# EAGLE schematic D710-gps (EAGLE 6.4)
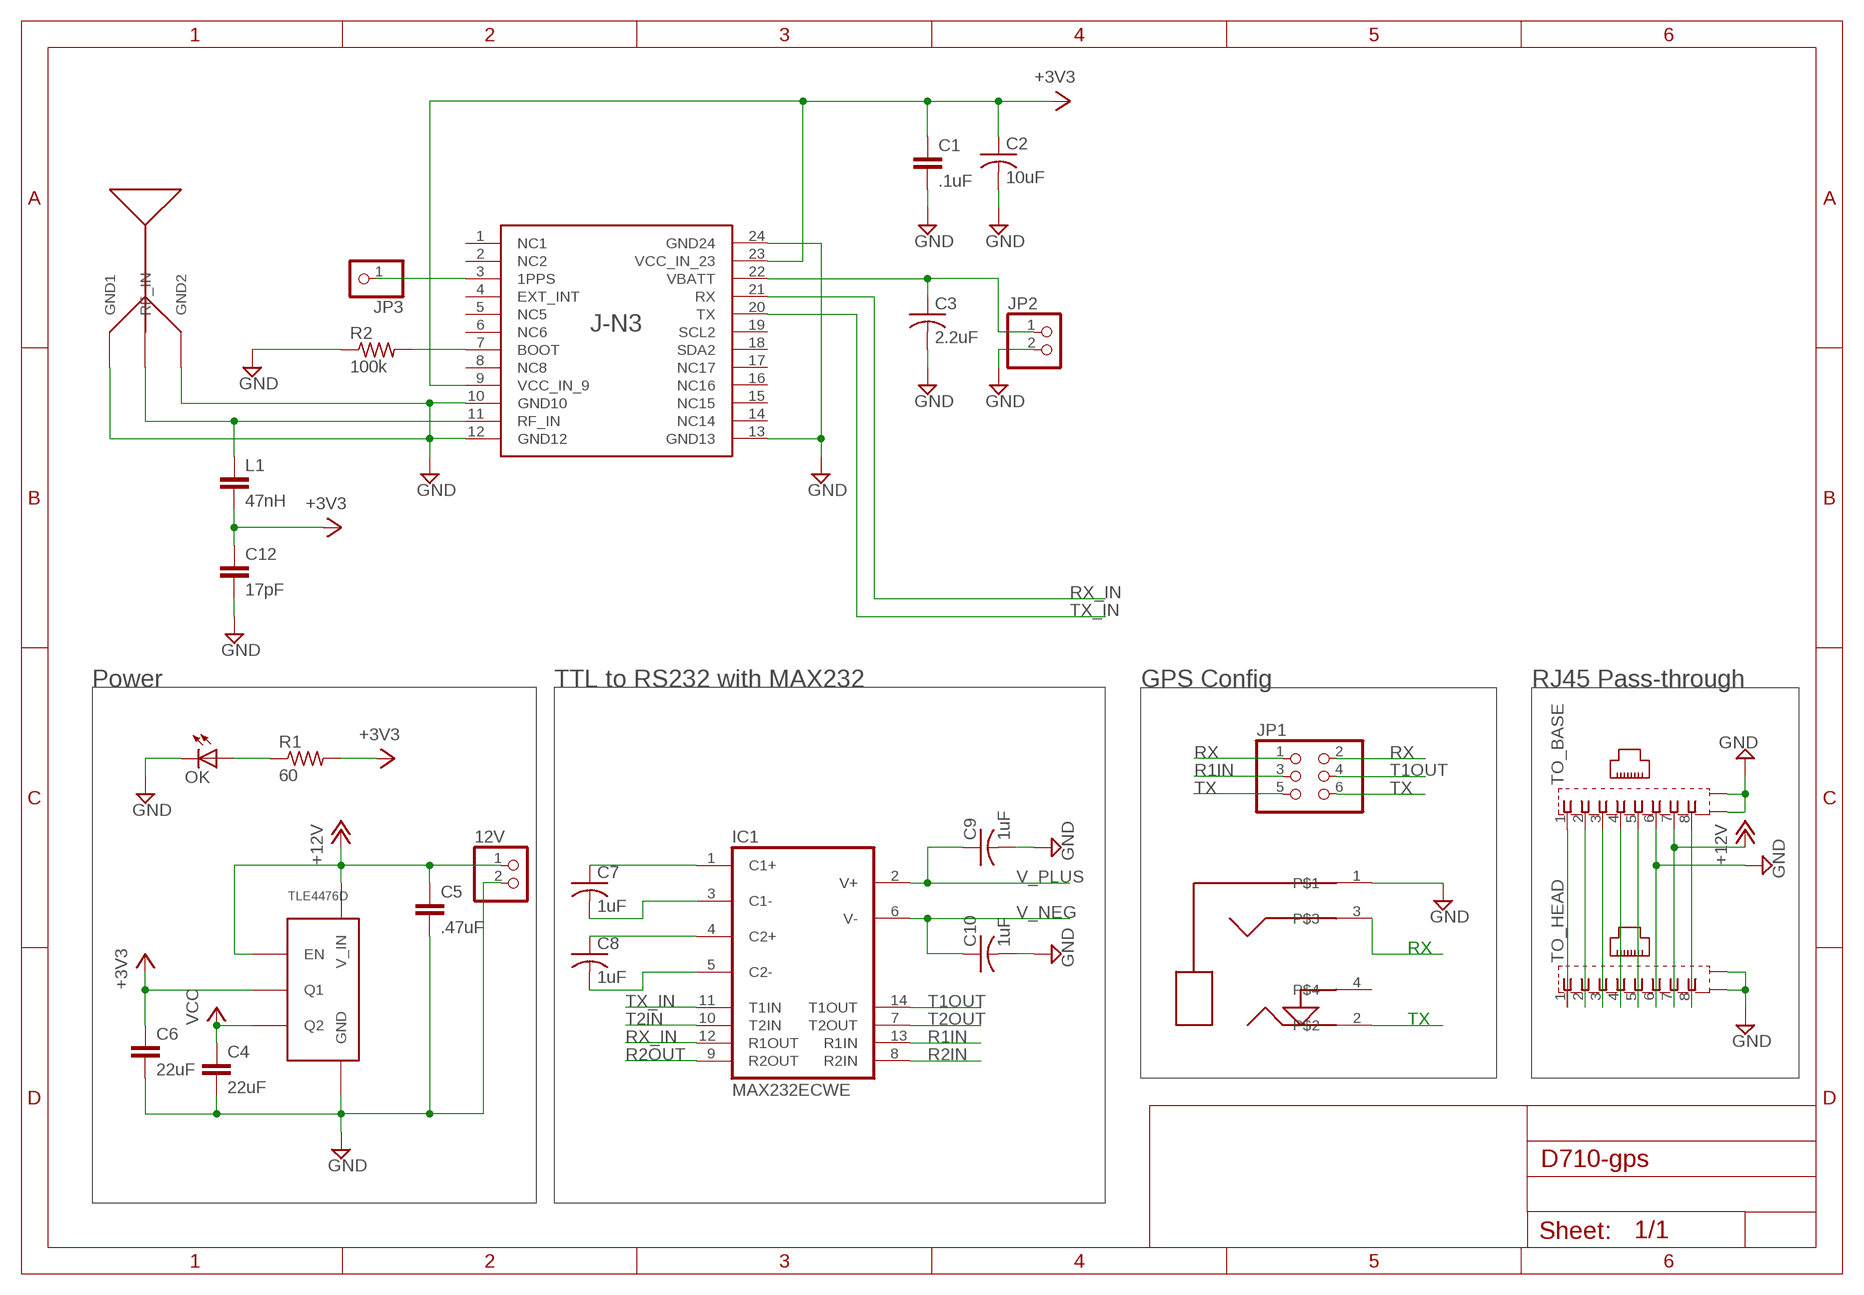
[diagram p0: schematic, sheet 1]

## Parts
12V  PINHD-1X2  [1X02]
ANT  GEO_HELIX_GPSANT  [GEO_HELIX_GPSANT]
C1  .1uF  C-EUC0805  [C0805]
C2  10uF  C-USC0805  [C0805]
C3  2.2uF  C-USC0805  [C0805]
C4  22uF  C-EUC0805  [C0805]
C5  .47uF  C-EUC0805  [C0805]
C6  22uF  C-EUC0805  [C0805]
C7  1uF  C-USC0805  [C0805]
C8  1uF  C-USC0805  [C0805]
C9  1uF  C-USC0805  [C0805]
C10  1uF  C-USC0805  [C0805]
C12  17pF  C-EUC0603  [C0603]
GPS  2.5MM_JACK  [2.5MM_AUDIO]
IC1  MAX232ECWE  [SO16L]
JP1  PINHD-2X3  [2X03]
JP2  PINHD-1X2  [1X02]
JP3  PINHD-1X1  [1X01]
L1  47nH  C-EUC0603  [C0603]
OK  LEDCHIPLED_0805  [CHIPLED_0805]
R1  60  R-US_R0805  [R0805]
R2  100k  R-US_R0603  [R0603]
TLE4476D  TLE4476D  [TO-252-5]
TO_BASE  555141-1  [555153-1]
TO_HEAD  555141-1  [555153-1]
U$1  TELIT_JN3  [24-SMD]

## Nets
+3V3: C1.1 C2.1 C6.1 C12.1 L1.2 R1.2 TLE4476D.Q1 U$1.9(VCC_IN_9) U$1.23(VCC_IN_23)
+5V: C4.1 TLE4476D.Q2 ; supply symbol labelled VCC
+12V: 12V.1 C5.1 TLE4476D.EN TLE4476D.V_IN TO_BASE.7 TO_HEAD.7
GND: 12V.2 ANT.GND1 ANT.GND2 C1.2 C2.2 C3.2 C4.2 C5.2 C6.2 C9.2 C10.2 C12.2 GPS.1 JP2.2 OK.C R2.1 TLE4476D.GND TO_BASE.6 TO_BASE.G1(S1) TO_BASE.G2(S2) TO_HEAD.6 TO_HEAD.G1(S1) TO_HEAD.G2(S2) U$1.10(GND10) U$1.12(GND12) U$1.13(GND13) U$1.24(GND24)
N$1: ANT.RF_IN L1.1 U$1.11(RF_IN)
N$2: OK.A R1.1
N$3: R2.2 U$1.7(BOOT)
N$4: C3.1 JP2.1 U$1.22(VBATT)
N$5: JP3.1 U$1.3(1PPS)
N$6: C7.1 IC1.1(C1+)
N$7: C7.2 IC1.3(C1-)
N$8: C8.1 IC1.4(C2+)
N$9: C8.2 IC1.5(C2-)
N$11: TO_BASE.1 TO_HEAD.1
N$12: TO_BASE.2 TO_HEAD.2
N$13: TO_BASE.3 TO_HEAD.3
N$14: TO_BASE.4 TO_HEAD.4
N$15: TO_BASE.5 TO_HEAD.5
N$18: TO_BASE.8 TO_HEAD.8
R1IN: IC1.13(R1IN) JP1.3
R2IN: IC1.8(R2IN)
R2OUT: IC1.9(R2OUT)
RX: GPS.3 JP1.1 JP1.2
RX_IN: IC1.12(R1OUT) U$1.21(RX)
T1OUT: IC1.14(T1OUT) JP1.4
T2IN: IC1.10(T2IN)
T2OUT: IC1.7(T2OUT)
TX: GPS.2 JP1.5 JP1.6
TX_IN: IC1.11(T1IN) U$1.20(TX)
V_NEG: C10.1 IC1.6(V-)
V_PLUS: C9.1 IC1.2(V+)
Unconnected: GPS.4 U$1.1(NC1) U$1.2(NC2) U$1.4(EXT_INT) U$1.5(NC5) U$1.6(NC6) U$1.8(NC8) U$1.14(NC14) U$1.15(NC15) U$1.16(NC16) U$1.17(NC17) U$1.18(SDA2) U$1.19(SCL2)

## Notes on the sheet
- Power | TTL to RS232 with MAX232 | GPS Config | RJ45 Pass-through
- RX
- TX

## Power pins joined to a net without a drawn wire
GND: IC1.15(GND)
VCC: IC1.16(VCC)

## Library data of the parts
12V JP2 = pinhead:PINHD-1X2: PIN HEADER; OC_NEWARK: unknown
ANT = My_Parts:GEO_HELIX_GPSANT: Built on patented PowerHelix® filtering antenna technology, the SL1204 surface-mount GPS antenna is the smallest active quadrifilar helix antenna available, providing high performance in difficult GPS applications. The SL1204 integrates a high-performance, optimised gain, low-noise amplifier with Sarantel's GeoHelix®-P2 antenna for receivers requiring an active input. The SL1204 has been optimally designed to work best with the latest generation of GPS chipsets. Radomed Antenna for external integration. Also available in sleeved configuration for internal (embedded) integration - SL1204SB.
C1 C4-C6 = rcl:C-EU: CAPACITOR, European symbol; OC_NEWARK: unknown
C2 = rcl:C-US: CAPACITOR, American symbol; MPN: 06034D106MAT2A; OC_NEWARK: 10R5934
C3 = rcl:C-US: CAPACITOR, American symbol; OC_NEWARK: unknown
C7-C10 = rcl:C-US: CAPACITOR, American symbol; MPN: 02016D105MAT2A; OC_NEWARK: 37T9044
C12 L1 = rcl:C-EU: CAPACITOR, European symbol
GPS = My_Parts:2.5MM_JACK: 2.5 MM AUDIO JACK http://www.cui.com/product/resource/sj-252x-smt-series.pdf; OC_NEWARK: unknown
IC1 = maxim:MAX232ECWE: RS232 TRANSEIVER; MF: MAXIM; MPN: MAX232ECWE+; OC_FARNELL: 9724435; OC_NEWARK: 67K4440
JP1 = pinhead:PINHD-2X3: PIN HEADER; OC_NEWARK: unknown
JP3 = pinhead:PINHD-1X1: PIN HEADER; OC_NEWARK: unknown
OK = led:LED: LED OSRAM: - CHIPLED LG R971, LG N971, LY N971, LG Q971, LY Q971, LO R971, LY R971 LH N974, LH R974 LS Q976, LO Q976, LY Q976 LO Q996 - Hyper CHIPLED LW Q18S LB Q993, LB Q99A, LB R99A - SideLED LS A670, LO A670, LY A670, LG A670, LP A670 LB A673, LV A673, LT A673, LW A673 LH A674 LY A675 LS A676, LA A676, LO A676, LY A676, LW A676 LS A679, LY A679, LG A679 - Hyper Micro SIDELED® LS Y876, LA Y876, LO Y876, LY Y876 LT Y87S - SmartLED LW L88C, LW L88S LB L89C, LB L89S, LG L890 LS L89K, LO L89K, LY L89K LS L896, LA L896, LO L896, LY L896 - TOPLED LS T670, LO T670, LY T670, LG T670, LP T670 LSG T670, LSP T670, LSY T670, LOP T670, LYG T670 LG T671, LOG T671, LSG T671 LB T673, LV T673, LT T673, LW T673 LH T674 LS T676, LA T676, LO T676, LY T676, LB T676, LH T676, LSB T676, LW T676 LB T67C, LV T67C, LT T67C, LS T67K, LO T67K, LY T67K, LW E67C LS E67B, LA E67B, LO E67B, LY E67B, LB E67C, LV E67C, LT E67C LW T67C LS T679, LY T679, LG T679 LS T770, LO T770, LY T770, LG T770, LP T770 LB T773, LV T773, LT T773, LW T773 LH T774 LS E675, LA E675, LY E675, LS T675 LS T776, LA T776, LO T776, LY T776, LB T776 LHGB T686 LT T68C, LB T68C - Hyper Mini TOPLED® LB M676 - Mini TOPLED Santana® LG M470 LS M47K, LO M47K, LY M47K Source: http://www.osram.convergy.de LUXEON: - LUMILED® LXK2-PW12-R00, LXK2-PW12-S00, LXK2-PW14-U00, LXK2-PW14-V00 LXK2-PM12-R00, LXK2-PM12-S00, LXK2-PM14-U00 LXK2-PE12-Q00, LXK2-PE12-R00, LXK2-PE12-S00, LXK2-PE14-T00, LXK2-PE14-U00 LXK2-PB12-K00, LXK2-PB12-L00, LXK2-PB12-M00, LXK2-PB14-N00, LXK2-PB14-P00, LXK2-PB14-Q00 LXK2-PR12-L00, LXK2-PR12-M00, LXK2-PR14-Q00, LXK2-PR14-R00 LXK2-PD12-Q00, LXK2-PD12-R00, LXK2-PD12-S00 LXK2-PH12-R00, LXK2-PH12-S00 LXK2-PL12-P00, LXK2-PL12-Q00, LXK2-PL12-R00 Source: www.luxeon.com KINGBRIGHT: KA-3528ASYC Source: www.kingbright.com; OC_NEWARK: unknown
R1 R2 = rcl:R-US_: RESISTOR, American symbol; OC_NEWARK: unknown
TLE4476D = My_Parts:TLE4476D: The TLE 4476 is a monolithic integrated voltage regulator providing two output voltages, Q1 is a 3.3 V output for loads up to 350 mA and Q2 is a 5 V output providing 430 mA. The device is available in the PG-TO252-5-11 (D-Pak) package. Output 2 can be switched ON/OFF via the Enable input EN.; OC_NEWARK: unknown
TO_BASE TO_HEAD = con-amp:555141-1: AMP connector; OC_NEWARK: unknown
U$1 = My_Parts:TELIT_JN3: Device for Telit JN3 GPS module; OC_NEWARK: unknown